# EAGLE design Codeshelf-0009.v02 (EAGLE 6.5.0)
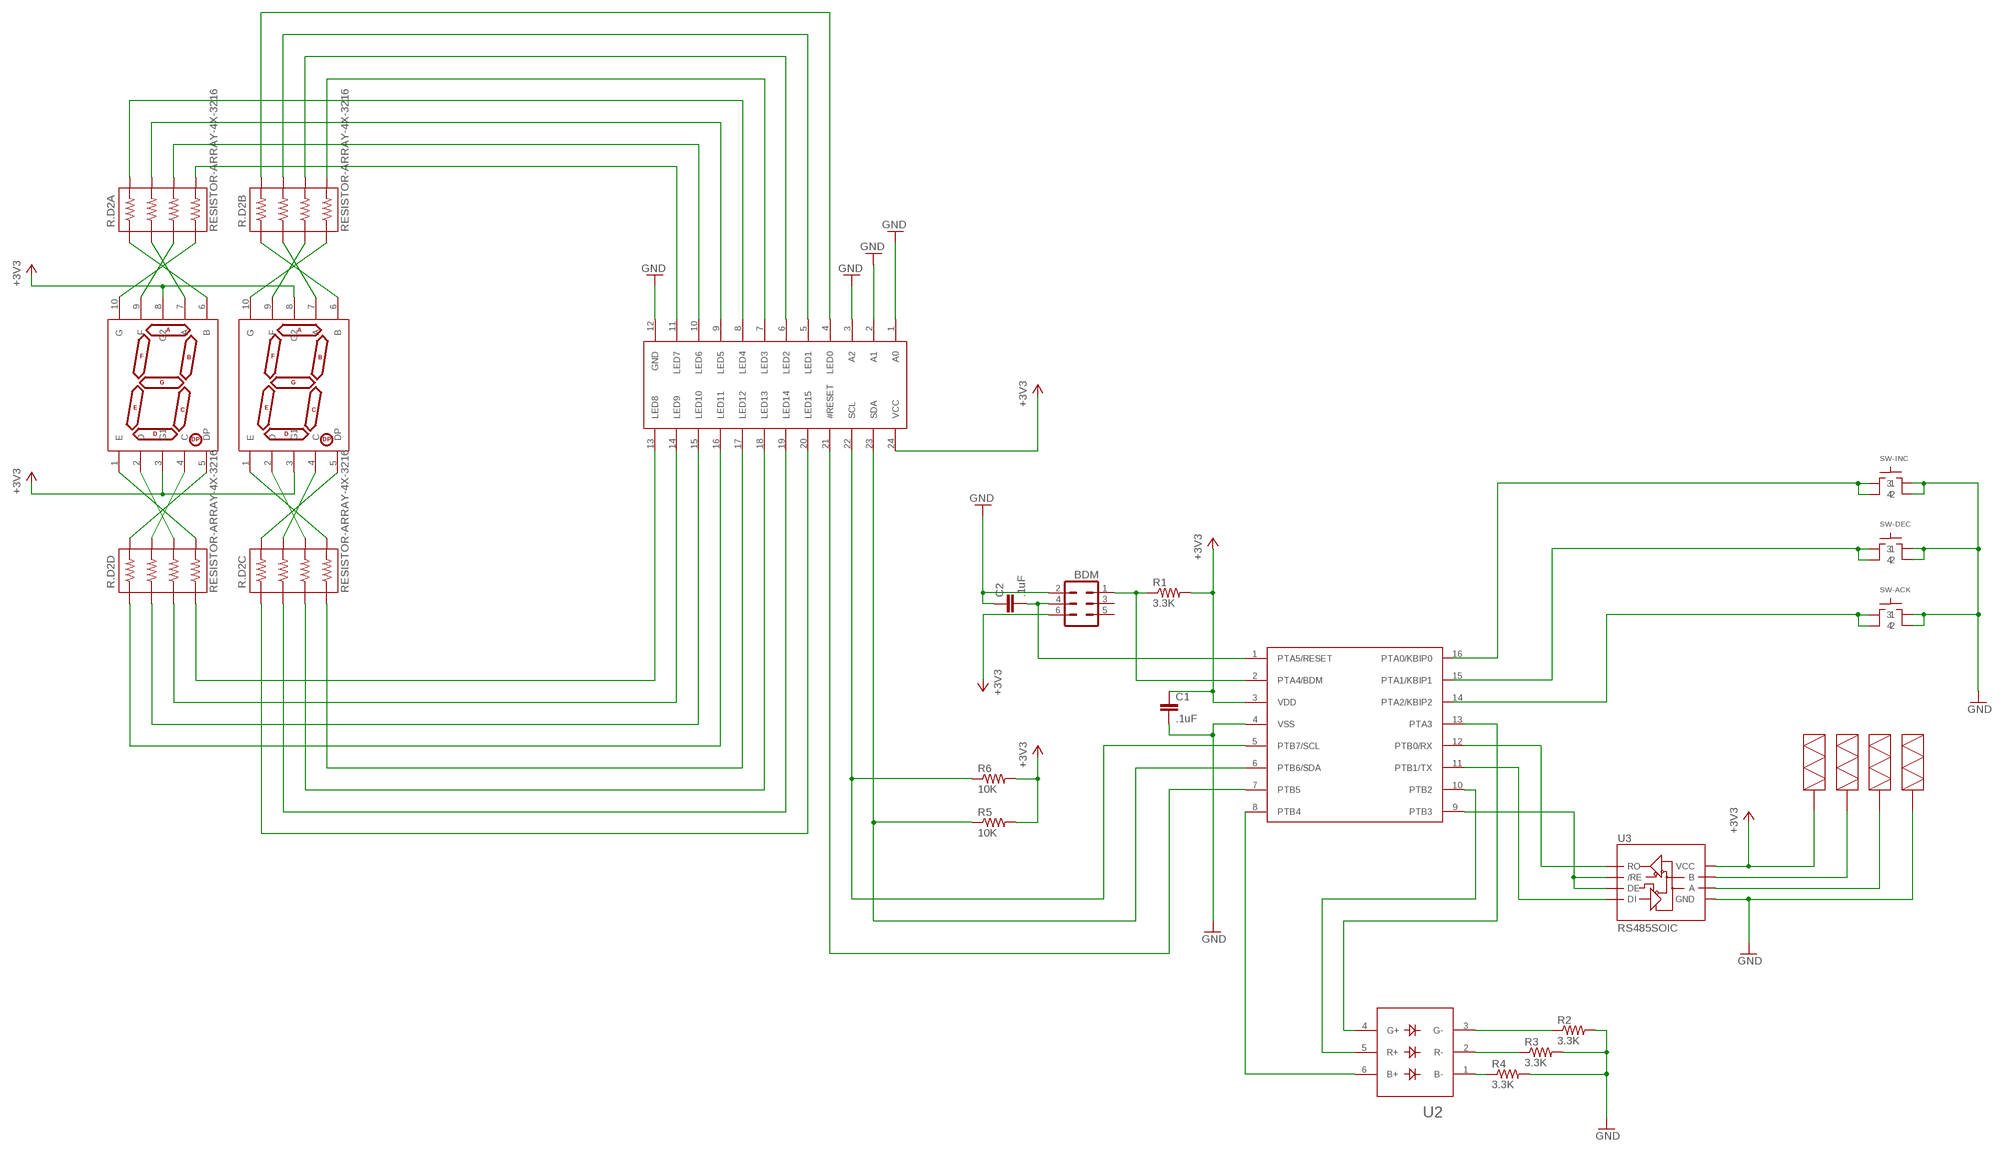
[diagram p0: schematic, sheet 1]

## Parts
BDM  HEADER-3X2  [HEADER-3X2]
C1  .1uF  RF-C0402  [C0402]
C2  .1uF  RF-C0402  [C0402]
J1  CONTACT-SPRING-S7071-42R  CONTACT-SPRING-S1761  [CONTACT-SPRING-S1761]
J2  CONTACT-SPRING-S7071-42R  CONTACT-SPRING-S1761  [CONTACT-SPRING-S1761]
J3  CONTACT-SPRING-S7071-42R  CONTACT-SPRING-S1761  [CONTACT-SPRING-S1761]
J4  CONTACT-SPRING-S7071-42R  CONTACT-SPRING-S1761  [CONTACT-SPRING-S1761]
LED1  7SEGMENT-1DIGITSMD  [7SEGMENT-1DIG-.40-SMD]
LED2  7SEGMENT-1DIGITSMD  [7SEGMENT-1DIG-.40-SMD]
R1  3.3K  RF-R0402  [RF-R0402]
R2  3.3K  RF-R0402  [RF-R0402]
R3  3.3K  RF-R0402  [RF-R0402]
R4  3.3K  RF-R0402  [RF-R0402]
R5  10K  RF-R0402  [RF-R0402]
R6  10K  RF-R0402  [RF-R0402]
R.D2A  RESISTOR-ARRAY-4X-3216  [3216-4X]
R.D2B  RESISTOR-ARRAY-4X-3216  [3216-4X]
R.D2C  RESISTOR-ARRAY-4X-3216  [3216-4X]
R.D2D  RESISTOR-ARRAY-4X-3216  [3216-4X]
SW-ACK  SWITCH-TACTILE-320.03E11  [SWITCH-TACTILE-320.03E11]
SW-DEC  SWITCH-TACTILE-FSM  [SWITCH-TACTILE-FSM]
SW-INC  SWITCH-TACTILE-FSM  [SWITCH-TACTILE-FSM]
U1  MC9S08QG-DT  [TSSOP16]
U2  LED5060A  [PLCC-6]
U3  RS485SOIC  [SO08]
U4  CAT9552  [TSSOP24]

## Nets
+3V3 [+3V3]: BDM.6 C1.1 J1.P1 LED1.3(G1) LED1.8(G2) LED2.3(G1) LED2.8(G2) R1.2 R5.2 R6.2 U1.3(VDD) U3.8(VCC) U4.24(VCC)
A: J3.P1 U3.6(A)
B: J2.P1 U3.7(B)
GND [GND]: BDM.2 C1.2 C2.1 J4.P1 R2.2 R3.2 R4.2 SW-ACK.P$3 SW-ACK.P$4 SW-DEC.P$3 SW-DEC.P$4 SW-INC.P$3 SW-INC.P$4 U1.4(VSS) U3.5(GND) U4.1(A0) U4.2(A1) U4.3(A2) U4.12(GND)
N$1: R2.1 U2.3(G-)
N$2: R.D2A.5(4B) U4.11(LED7)
N$3: R3.1 U2.2(R-)
N$4: R4.1 U2.1(B-)
N$5: U1.13(PTA3) U2.4(G+)
N$6: U1.10(PTB2) U2.5(R+)
N$7: U1.8(PTB4) U2.6(B+)
N$8: R.D2A.6(3B) U4.10(LED6)
N$9: BDM.1 R1.1 U1.2(PTA4/BDM)
N$10: R.D2A.7(2B) U4.9(LED5)
N$11: R.D2A.8(1B) U4.8(LED4)
N$12: R.D2B.5(4B) U4.7(LED3)
N$13: R.D2B.6(3B) U4.6(LED2)
N$14: R.D2B.7(2B) U4.5(LED1)
N$15: R.D2B.8(1B) U4.4(LED0)
N$16: LED2.6(B) R.D2A.1(1A)
N$17: LED2.7(A) R.D2A.2(2A)
N$18: LED2.9(F) R.D2A.3(3A)
N$19: U1.9(PTB3) U3.2(/RE) U3.3(DE)
N$20: LED2.10(G) R.D2A.4(4A)
N$21: LED2.5(DP) R.D2D.8(1B)
N$22: LED2.4(C) R.D2D.7(2B)
N$23: BDM.4 C2.2 U1.1(PTA5/RESET)
N$24: LED2.2(D) R.D2D.6(3B)
N$25: LED2.1(E) R.D2D.5(4B)
N$26: LED1.6(B) R.D2B.1(1A)
N$27: LED1.7(A) R.D2B.2(2A)
N$28: LED1.9(F) R.D2B.3(3A)
N$29: LED1.10(G) R.D2B.4(4A)
N$30: LED1.5(DP) R.D2C.8(1B)
N$31: R.D2D.4(4A) U4.13(LED8)
N$32: R.D2D.3(3A) U4.14(LED9)
N$33: R.D2D.2(2A) U4.15(LED10)
N$34: R.D2D.1(1A) U4.16(LED11)
N$35: R.D2C.4(4A) U4.17(LED12)
N$36: R.D2C.3(3A) U4.18(LED13)
N$37: R.D2C.2(2A) U4.19(LED14)
N$38: R.D2C.1(1A) U4.20(LED15)
N$39: LED1.4(C) R.D2C.7(2B)
N$40: LED1.2(D) R.D2C.6(3B)
N$41: LED1.1(E) R.D2C.5(4B)
N$42: SW-ACK.P$1 SW-ACK.P$2
N$43: SW-DEC.P$1 SW-DEC.P$2
N$44: SW-INC.P$1 SW-INC.P$2
RESET: U1.7(PTB5) U4.21(#RESET)
RX: U1.12(PTB0/RX) U3.1(RO)
SLA: R5.1 U1.6(PTB6/SDA) U4.23(SDA)
SLC: R6.1 U1.5(PTB7/SCL) U4.22(SCL)
TX: U1.11(PTB1/TX) U3.4(DI)
Unconnected: BDM.3 BDM.5 U1.14(PTA2/KBIP2) U1.15(PTA1/KBIP1) U1.16(PTA0/KBIP0)

## Library data of the parts
BDM = GW-devices:HEADER-3X2
C1 C2 = GW-devices:RF-C: RF capacitor pads for FSL reference design; MFGN: Murata; MFGP: GRM033R61A104KE15D; PRICE: 0.02
J1-J4 = GW-devices:CONTACT-SPRING; MFGN: Harwin; MFGP: S1761-46R; PRICE: 0.39
LED1 LED2 = GW-devices:7SEGMENT-1DIGIT
R1-R4 = GW-devices:RF-R: RF resistor pads for FSL reference design; MFGN: Panasonic; MFGP: ERJ-2GEJ332X; PRICE: 0.02
R5 R6 = GW-devices:RF-R: RF resistor pads for FSL reference design; MFGN: Panasonic; MFGP: ERJ-2GEJ103X; PRICE: 0.02
R.D2A R.D2B R.D2C R.D2D = GW-devices:RESISTOR-ARRAY-4X; MFGN: Yageo; MFGP: YC164-JR-07120RL; PRICE: 0.006
SW-ACK = GW-devices:SWITCH-TACTILE; MFGN: ESwitch; MFGP: 320.03E11
SW-DEC SW-INC = GW-devices:SWITCH-TACTILE; MFGN: TE Connectivity; MFGP: FSM16JH; PRICE: 0.18
U1 = GW-devices:MC9S08QG; MFGN: Freescale; MFGP: MC9S08QG8CDTER; PRICE: 1.73
U2 = GW-devices:LED5060: PLCC-6 5060 6000mcd RGB LED; PRICE: 0.25
U3 = SparkFun:RS485; MFGN: TI; MFGP: SN65HVD1781DR; PRICE: 4.29
U4 = GW-devices:CAT9552; MFGN: On Semiconductor; MFGP: CAT9552YI-T2; PRICE: 1.28

## Net classes
1 +3V3: width 0.3 mm
2 GND: width 0.3 mm

## Board
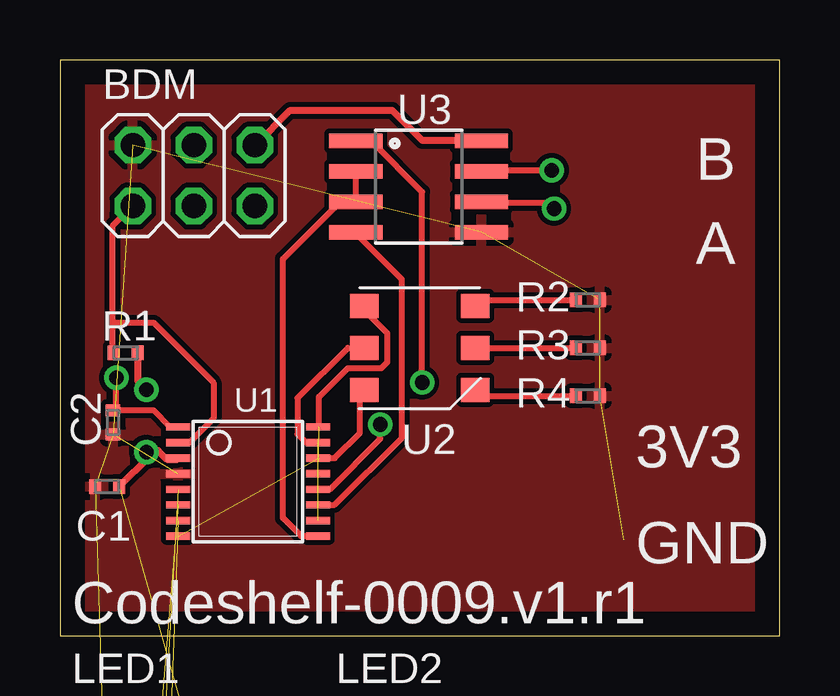
[diagram p1: board, top side]
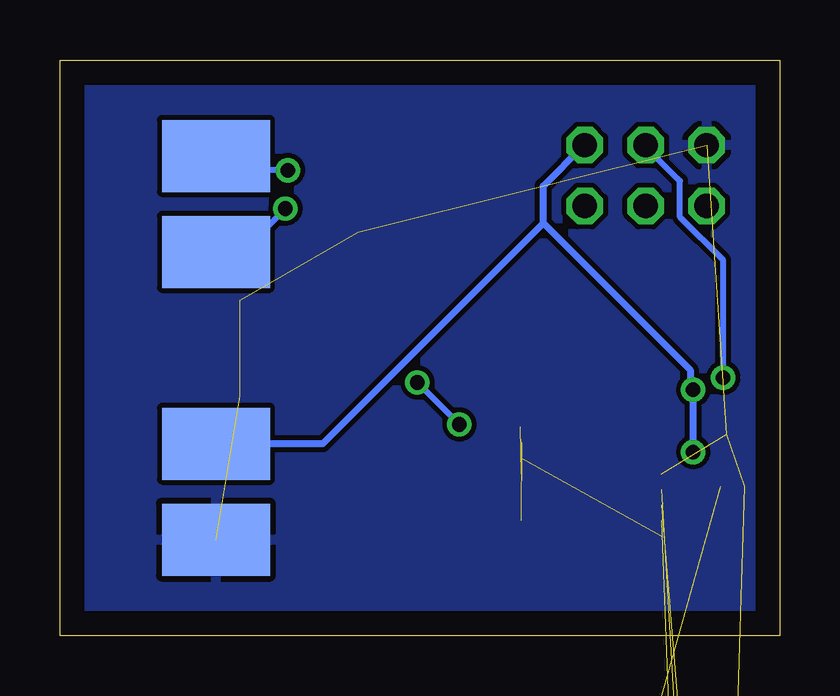
[diagram p2: board, bottom side, seen from below]

Size 30 x 24 mm. Coordinates in mm from the lower left corner, seen from the top.
Outline: 0,0 30,0 30,24 0,24 0,0
Copper layers (1*16): Top 0.035mm / dielectric 1.5mm / Bottom 0.035mm
Design rules "default": minimum track width 10mil, minimum drill 24mil, track to track 8mil, track to pad 8mil, pad to pad 8mil, via to via 8mil, smd to smd 8mil, copper to edge 40mil, drill to drill 8mil, minimum pad ring 10mil, minimum via ring 8mil, stop-mask expansion 4mil, vias tented up to drill 0mil, thermal gap 10mil

### Footprints (pad centres in the part's own frame; a part is rotated, then mirrored left to right if it is on the bottom)
HEADER-3X2 = drill 1.016 octagon: 1 -5.08,0; 2 -5.08,2.54; 3 -2.54,0; 4 -2.54,2.54; 5 0,0; 6 0,2.54
C0402 = smd 0.5 x 0.6: 1 -0.5,0; 2 0.5,0
CONTACT-SPRING-S1761 = smd 3 x 4.5: P1 0,0
7SEGMENT-1DIG-.40-SMD = smd 1.2 x 3: 1 -3.76,-7.5; 2 -1.88,-7.5; 3 0,-7.5; 4 1.88,-7.5; 5 3.76,-7.5; 6 3.76,7.5; 7 1.88,7.5; 8 0,7.5; 9 -1.88,7.5; 10 -3.76,7.5
RF-R0402 = smd 0.5 x 0.6: 1 -0.5,0; 2 0.5,0
3216-4X = smd 0.65 x 0.9: 1 -1.275,-0.85; 4 1.275,-0.85; 5 1.275,0.85; 8 -1.275,0.85 | smd 0.5 x 0.9: 2 -0.4,-0.85; 3 0.4,-0.85; 6 0.4,0.85; 7 -0.4,0.85
SWITCH-TACTILE-320.03E11 = drill 1.22: P$1 -3.81,-3.81; P$2 -1.27,3.81; P$3 1.27,1.27; P$4 3.81,-3.81
SWITCH-TACTILE-FSM = drill 0.99: P$1 -3.25,2.25; P$2 3.25,2.25; P$3 -3.25,-2.25; P$4 3.25,-2.25
TSSOP16 = smd 0.305 x 0.991: 1 -2.275,-2.918; 2 -1.625,-2.918; 3 -0.975,-2.918; 4 -0.325,-2.918; 5 0.325,-2.918; 6 0.975,-2.918; 7 1.625,-2.918; 8 2.275,-2.918; 9 2.275,2.918; 10 1.625,2.918; 11 0.975,2.918; 12 0.325,2.918; 13 -0.325,2.918; 14 -0.975,2.918; 15 -1.625,2.918; 16 -2.275,2.918
PLCC-6 = smd 1.18 x 1: 1 -2.31,1.75; 2 -2.31,0; 3 -2.31,-1.75; 4 2.31,-1.75; 5 2.31,0; 6 2.31,1.75
SO08 = smd 0.61 x 2.21: 1 -1.905,-2.616; 2 -0.635,-2.616; 3 0.635,-2.616; 4 1.905,-2.616; 5 1.905,2.616; 6 0.635,2.616; 7 -0.635,2.616; 8 -1.905,2.616
TSSOP24 = smd 0.305 x 0.991: 1 -3.575,-2.918; 2 -2.925,-2.918; 3 -2.275,-2.918; 4 -1.625,-2.918; 5 -0.975,-2.918; 6 -0.325,-2.918; 7 0.325,-2.918; 8 0.975,-2.918; 9 1.625,-2.918; 10 2.275,-2.918; 11 2.925,-2.918; 12 3.575,-2.918; 13 3.575,2.918; 14 2.925,2.918; 15 2.275,2.918; 16 1.625,2.918; 17 0.975,2.918; 18 0.325,2.918; 19 -0.325,2.918; 20 -0.975,2.918; 21 -1.625,2.918; 22 -2.275,2.918; 23 -2.925,2.918; 24 -3.575,2.918

### Placement (x,y rotation side)
BDM  8.12,17.91 0 top
C1  1.96,6.21 180 top
C2  2.21,8.89 90 top
J1  23.5,8 270 bottom
J2  23.5,20 270 bottom
J3  23.5,16 270 bottom
J4  23.5,4 270 bottom
LED1  5.5,-12 0 top  (outside the outline)
LED2  16.5,-12 0 top  (outside the outline)
R1  2.74,11.79 0 top
R2  22,14 0 top
R3  22,12 0 top
R4  22,10 0 top
R5  12,-32 0 top  (outside the outline)
R6  16.5,-32 0 top  (outside the outline)
R.D2A  14,-24.5 0 top  (outside the outline)
R.D2B  19.5,-24.5 0 top  (outside the outline)
R.D2C  2.5,-33 0 top  (outside the outline)
R.D2D  8,-33 0 top  (outside the outline)
SW-ACK  6.5,-43 0 top  (outside the outline)
SW-DEC  4.5,-56 0 top  (outside the outline)
SW-INC  14,-56 0 top  (outside the outline)
U1  7.84,6.42 270 top
U2  15,12 180 top
U3  14.95,18.72 270 top
U4  5.5,-26 0 top  (outside the outline)

### Tracks (layer width: path | path; a pad name or v marks a point on that pad's centre or on a via)
+3V3  (via drill 0.61)  (7 unrouted)
  Top 0.3: 3.75,7.5 3.95,7.7 4.1,7.7 4.45,7.35 4.9,7.35 U1.3 | C1.1 3.75,7.5 | v3.6,10.25 3.25,10.6 3.25,11.75 R1.2 | 3.75,7.5 v3.6,7.65 | U3.8 17.55,20.65 15.1,20.65 13.85,21.9 9.6,21.9 8.15,20.45 BDM.6
  Bottom 0.3: v3.6,7.65 v3.6,10.25 3.7,10.35 3.7,11.05 9.85,17.2 | 9.85,17.2 9.85,18.75 8.15,20.45 BDM.6 | J1.P1 19.05,8 9.85,17.2
A  (via drill 0.61)
  Top 0.254: v20.6,17.8 20.35,18.05 17.6,18.05 U3.6
  Bottom 0.254: v20.6,17.8 22.4,16 J3.P1
B  (via drill 0.61)
  Top 0.254: v20.5,19.4 17.6,19.4 U3.7
  Bottom 0.254: v20.5,19.4 22.9,19.4 J2.P1
GND  (18 unrouted)
  pour Bottom: 0,0 30,0 30,24 0,24
  pour Top: 0,0 30,0 30,24 0,24
N$1
  Top 0.254: R2.1 17.6,14 17.35,13.75 U2.3
N$2  (1 unrouted)
N$3
  Top 0.254: U2.2 R3.1
N$4
  Top 0.254: R4.1 17.6,10 17.35,10.25 U2.1
N$5  (1 unrouted)
  Top 0.254: 10.8,8.7 10.8,9.95 12,11.15 13.4,11.15 13.65,11.4 13.65,12.6 12.7,13.55 U2.4
N$6  (1 unrouted)
  Top 0.254: 10.75,8.05 10.25,8.05 9.9,8.4 9.9,9.9 12,12 U2.5
N$7  (1 unrouted)
  Top 0.254: 10.8,7.4 11.45,7.4 12.5,8.45 12.5,10.1 12.65,10.25 U2.6
N$8  (1 unrouted)
N$9
  Top 0.254: 2.2,13.05 2.2,17.1 3,17.9 BDM.1 | 2.2,13.05 2.2,11.8 R1.1 | U1.2 4.95,8.05 5.4,8.05 6.4,9.05 6.4,10.55 3.9,13.05 2.2,13.05
N$10  (1 unrouted)
N$11  (1 unrouted)
N$12  (1 unrouted)
N$13  (1 unrouted)
N$14  (1 unrouted)
N$15  (1 unrouted)
N$16  (1 unrouted)
N$17  (1 unrouted)
N$18  (1 unrouted)
N$19
  Top 0.254: U1.9 10.05,4.15 9.3,4.9 9.3,15.7 11.65,18.05 12.3,18.05 U3.3 12.35,18.2 12.35,19.35 U3.2
N$20  (1 unrouted)
N$21  (1 unrouted)
N$22  (1 unrouted)
N$23  (via drill 0.61)
  Top 0.254: U1.1 4.9,8.7 4.6,8.7 3.9,9.4 2.25,9.4 C2.2 2.35,9.5 v2.35,10.75
  Bottom 0.254: v2.35,10.75 2.35,15.65 4.15,17.45 4.15,18.95 5.55,20.35 5.55,20.45 BDM.4
N$24  (1 unrouted)
N$25  (1 unrouted)
N$26  (1 unrouted)
N$27  (1 unrouted)
N$28  (1 unrouted)
N$29  (1 unrouted)
N$30  (1 unrouted)
N$31  (1 unrouted)
N$32  (1 unrouted)
N$33  (1 unrouted)
N$34  (1 unrouted)
N$35  (1 unrouted)
N$36  (1 unrouted)
N$37  (1 unrouted)
N$38  (1 unrouted)
N$39  (1 unrouted)
N$40  (1 unrouted)
N$41  (1 unrouted)
N$42  (1 unrouted)
N$43  (1 unrouted)
N$44  (1 unrouted)
RESET  (1 unrouted)
RX  (via drill 0.61)
  Top 0.254: v13.35,8.8 13.35,8.2 11.25,6.1 10.8,6.1 U1.12 | v15.1,10.55 15.1,18.5 13,20.6 12.35,20.6 U3.1
  Bottom 0.254: v13.35,8.8 v15.1,10.55
SLA  (2 unrouted)
SLC  (2 unrouted)
TX
  Top 0.254: U1.11 10.8,5.45 11.45,5.45 14.25,8.25 14.25,14.85 12.3,16.8 U3.4

### Text on the board
tNames: B | A | 3V3 | GND | Codeshelf-0009.v1.r1